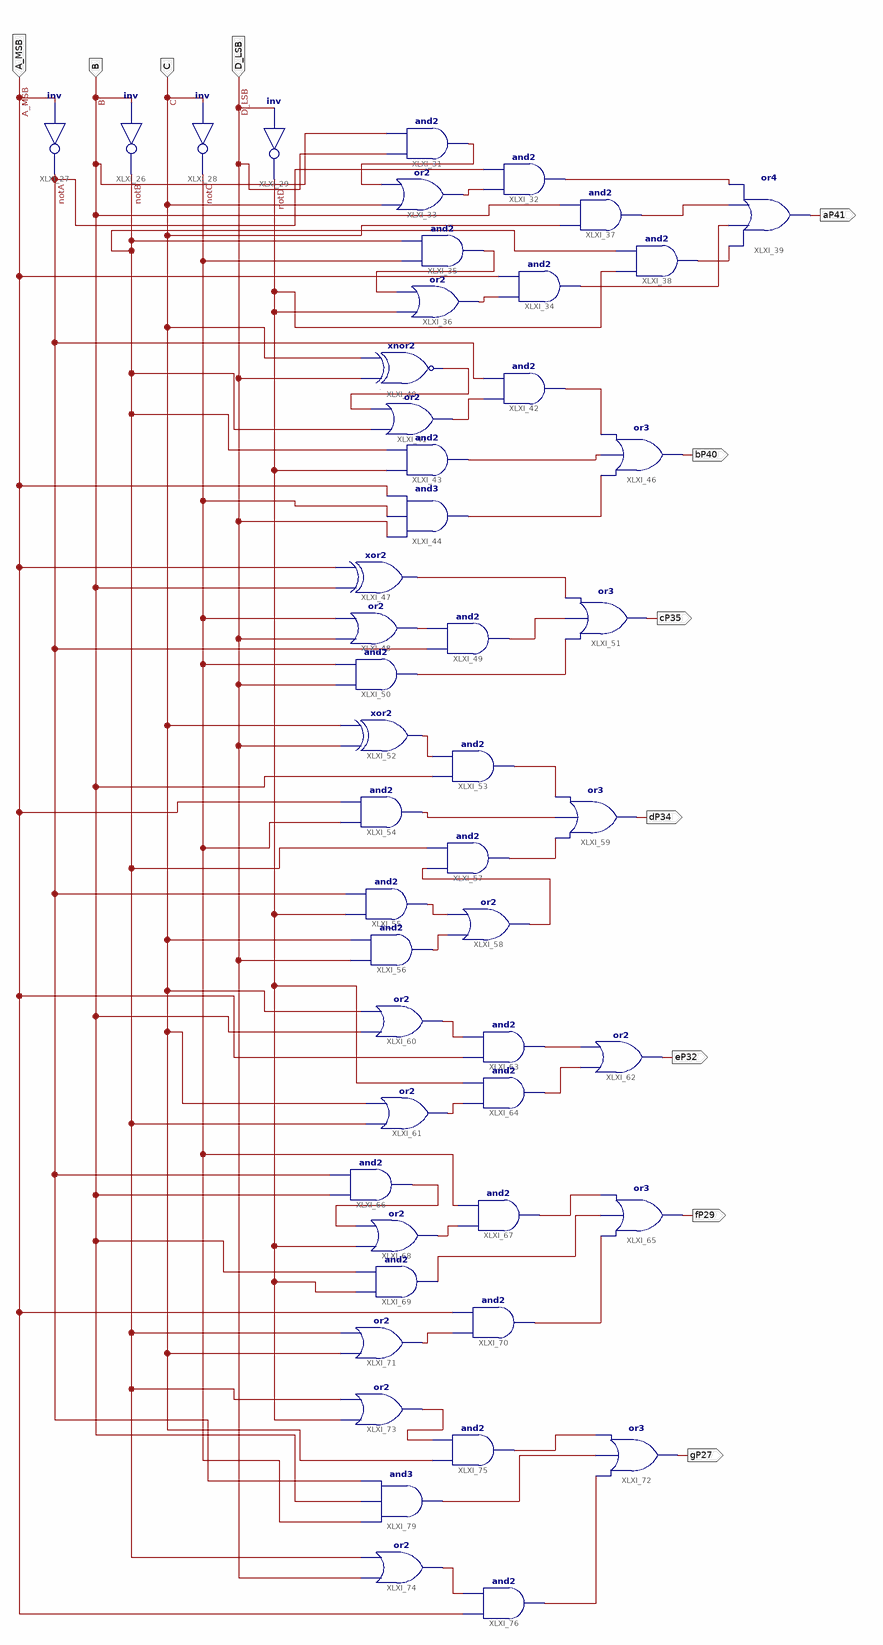
[diagram p0: schematic sheet 1]
// Xilinx ISE schematic BCD7Seg.sch (spartan6) as structural Verilog: 50 symbols, 11 ports
module BCD7Seg (
  input  A_MSB,
  input  B,
  input  C,
  input  D_LSB,
  output aP41,
  output bP40,
  output cP35,
  output dP34,
  output eP32,
  output fP29,
  output gP27
);

  wire notA, notB, notC, notD, XLXN_296, XLXN_297, XLXN_304, XLXN_305, XLXN_306, XLXN_307, XLXN_309,
       XLXN_310, XLXN_313, XLXN_314, XLXN_315, XLXN_317, XLXN_318, XLXN_322, XLXN_323, XLXN_324, XLXN_325,
       XLXN_327, XLXN_328, XLXN_329, XLXN_330, XLXN_331, XLXN_332, XLXN_333, XLXN_346, XLXN_348, XLXN_349,
       XLXN_350, XLXN_353, XLXN_354, XLXN_356, XLXN_357, XLXN_358, XLXN_359, XLXN_362, XLXN_363, XLXN_365,
       XLXN_371, XLXN_372;

  not XLXI_26 (notB, B);
  not XLXI_27 (notA, A_MSB);
  not XLXI_28 (notC, C);
  not XLXI_29 (notD, D_LSB);
  and XLXI_31 (XLXN_296, D_LSB, B);
  and XLXI_32 (XLXN_310, XLXN_297, notA);
  or XLXI_33 (XLXN_297, C, XLXN_296);
  and XLXI_34 (XLXN_306, XLXN_304, A_MSB);
  and XLXI_35 (XLXN_305, notC, notB);
  or XLXI_36 (XLXN_304, notD, XLXN_305);
  and XLXI_37 (XLXN_309, C, B);
  and XLXI_38 (XLXN_307, notD, notB);
  or XLXI_39 (aP41, XLXN_307, XLXN_306, XLXN_309, XLXN_310);
  xnor XLXI_40 (XLXN_313, D_LSB, C);
  or XLXI_41 (XLXN_314, notB, XLXN_313);
  and XLXI_42 (XLXN_315, XLXN_314, notA);
  and XLXI_43 (XLXN_317, notD, notB);
  and XLXI_44 (XLXN_318, D_LSB, notC, A_MSB);
  or XLXI_46 (bP40, XLXN_318, XLXN_317, XLXN_315);
  xor XLXI_47 (XLXN_323, B, A_MSB);
  or XLXI_48 (XLXN_322, D_LSB, notC);
  and XLXI_49 (XLXN_324, notA, XLXN_322);
  and XLXI_50 (XLXN_325, D_LSB, notC);
  or XLXI_51 (cP35, XLXN_325, XLXN_324, XLXN_323);
  xor XLXI_52 (XLXN_327, D_LSB, C);
  and XLXI_53 (XLXN_331, B, XLXN_327);
  and XLXI_54 (XLXN_332, notC, A_MSB);
  and XLXI_55 (XLXN_328, notD, notA);
  and XLXI_56 (XLXN_329, D_LSB, C);
  and XLXI_57 (XLXN_333, XLXN_330, notB);
  or XLXI_58 (XLXN_330, XLXN_329, XLXN_328);
  or XLXI_59 (dP34, XLXN_333, XLXN_332, XLXN_331);
  or XLXI_60 (XLXN_346, B, C);
  or XLXI_61 (XLXN_350, notB, C);
  or XLXI_62 (eP32, XLXN_349, XLXN_348);
  and XLXI_63 (XLXN_348, A_MSB, XLXN_346);
  and XLXI_64 (XLXN_349, XLXN_350, notD);
  or XLXI_65 (fP29, XLXN_359, XLXN_357, XLXN_356);
  and XLXI_66 (XLXN_353, B, notA);
  and XLXI_67 (XLXN_356, XLXN_354, notC);
  or XLXI_68 (XLXN_354, notD, XLXN_353);
  and XLXI_69 (XLXN_357, notD, B);
  and XLXI_70 (XLXN_359, XLXN_358, A_MSB);
  or XLXI_71 (XLXN_358, C, notB);
  or XLXI_72 (gP27, XLXN_372, XLXN_365, XLXN_363);
  or XLXI_73 (XLXN_362, notD, notB);
  and XLXI_75 (XLXN_363, C, XLXN_362);
  or XLXI_74 (XLXN_371, D_LSB, notB);
  and XLXI_76 (XLXN_372, A_MSB, XLXN_371);
  and XLXI_79 (XLXN_365, notC, B, notA);
endmodule
